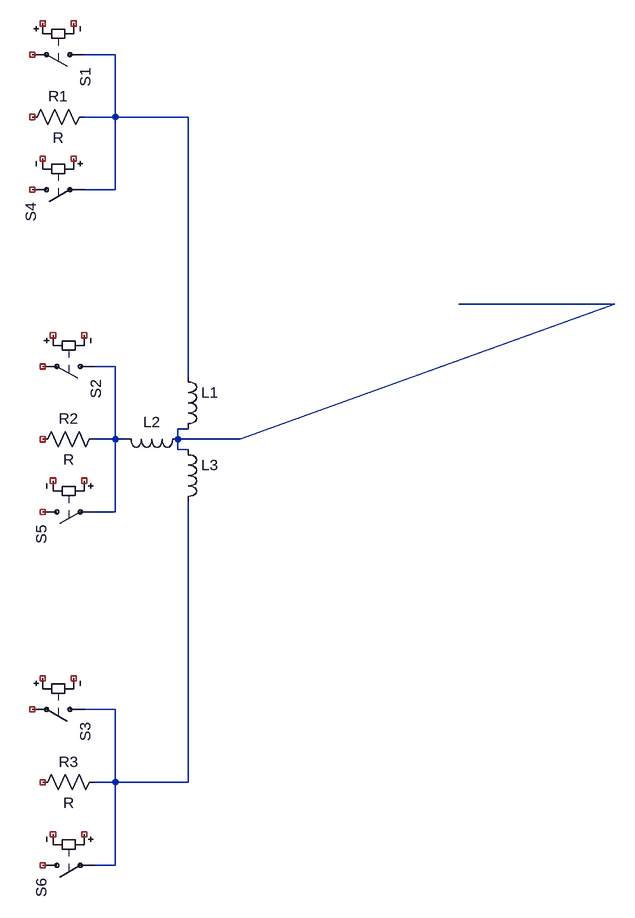
[diagram p0: schematic Draft1.asc]
Draft1.asc, the LTspice schematic file:
Version 4
SHEET 1 980 884
WIRE 208 -416 160 -416
WIRE 208 -320 208 -416
WIRE 208 -320 160 -320
WIRE 320 -320 208 -320
WIRE 208 -208 208 -320
WIRE 208 -208 160 -208
WIRE 976 -32 736 -32
WIRE 208 64 176 64
WIRE 320 80 320 -320
WIRE 320 160 304 160
WIRE 208 176 208 64
WIRE 208 176 176 176
WIRE 224 176 208 176
WIRE 304 176 304 160
WIRE 400 176 976 -32
WIRE 400 176 304 176
WIRE 304 192 304 176
WIRE 320 192 304 192
WIRE 208 288 208 176
WIRE 208 288 176 288
WIRE 208 592 160 592
WIRE 208 704 208 592
WIRE 208 704 176 704
WIRE 320 704 320 272
WIRE 320 704 208 704
WIRE 208 832 208 704
WIRE 208 832 176 832
SYMBOL ind 304 64 R0
SYMATTR InstName L1
SYMATTR Value ""
SYMBOL ind 320 160 R90
WINDOW 0 5 56 VBottom 2
WINDOW 3 32 56 VTop 2
SYMATTR InstName L2
SYMATTR Value ""
SYMBOL ind 304 176 R0
SYMATTR InstName L3
SYMATTR Value ""
SYMBOL res 176 -336 R90
WINDOW 0 0 56 VBottom 2
WINDOW 3 32 56 VTop 2
SYMATTR InstName R1
SYMBOL res 192 160 R90
WINDOW 0 0 56 VBottom 2
WINDOW 3 32 56 VTop 2
SYMATTR InstName R2
SYMBOL res 192 688 R90
WINDOW 0 0 56 VBottom 2
WINDOW 3 32 56 VTop 2
SYMATTR InstName R3
SYMBOL sw 176 -416 R90
WINDOW 0 20 14 Left 2
WINDOW 3 -62 -40 Left 2
SYMATTR InstName S1
SYMATTR Value ""
SYMBOL sw 192 64 R90
WINDOW 0 20 14 Left 2
WINDOW 3 -62 -40 Left 2
SYMATTR InstName S2
SYMATTR Value ""
SYMBOL sw 176 592 R90
WINDOW 0 20 14 Left 2
WINDOW 3 -62 -40 Left 2
SYMATTR InstName S3
SYMATTR Value ""
SYMBOL sw 64 -208 M90
WINDOW 0 20 14 Left 2
WINDOW 3 -62 -40 Left 2
SYMATTR InstName S4
SYMATTR Value ""
SYMBOL sw 80 288 M90
WINDOW 0 20 14 Left 2
WINDOW 3 -62 -40 Left 2
SYMATTR InstName S5
SYMATTR Value ""
SYMBOL sw 80 832 M90
WINDOW 0 20 14 Left 2
WINDOW 3 -62 -40 Left 2
SYMATTR InstName S6
SYMATTR Value ""

The netlist it stands for:
* Draft1.asc
L1 N001 N002
L2 N002 N003
L3 N002 N004
R1 N001 NC_01 R
R2 N003 NC_02 R
R3 N004 NC_03 R
S1 N001 NC_04 NC_05 NC_06
S2 N003 NC_07 NC_08 NC_09
S3 N004 NC_10 NC_11 NC_12
S4 NC_13 N001 NC_14 NC_15
S5 NC_16 N003 NC_17 NC_18
S6 NC_19 N004 NC_20 NC_21
.backanno
.end